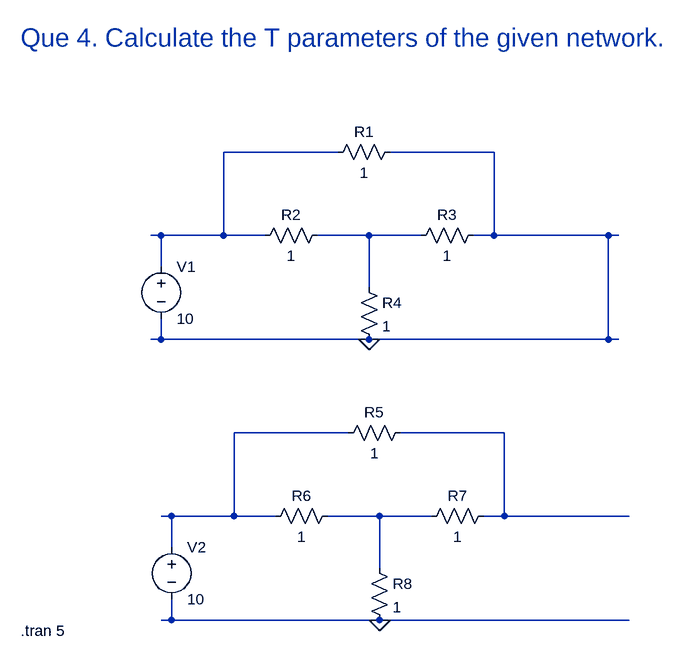
[diagram p0: schematic 4_Dheerendra_23EE019_Two_port_T_Para.asc]
4_Dheerendra_23EE019_Two_port_T_Para.asc, the LTspice schematic file:
Version 4
SHEET 1 880 832
WIRE 224 80 48 80
WIRE 464 80 304 80
WIRE -48 208 -64 208
WIRE 48 208 48 80
WIRE 48 208 -48 208
WIRE 112 208 48 208
WIRE 272 208 192 208
WIRE 352 208 272 208
WIRE 464 208 464 80
WIRE 464 208 432 208
WIRE 640 208 464 208
WIRE 656 208 640 208
WIRE -48 256 -48 208
WIRE 272 288 272 208
WIRE -48 368 -48 336
WIRE -48 368 -64 368
WIRE 272 368 -48 368
WIRE 640 368 640 208
WIRE 640 368 272 368
WIRE 656 368 640 368
WIRE 240 512 64 512
WIRE 480 512 320 512
WIRE -32 640 -48 640
WIRE 64 640 64 512
WIRE 64 640 -32 640
WIRE 128 640 64 640
WIRE 288 640 208 640
WIRE 368 640 288 640
WIRE 480 640 480 512
WIRE 480 640 448 640
WIRE 672 640 480 640
WIRE -32 688 -32 640
WIRE 288 720 288 640
WIRE -32 800 -32 768
WIRE -32 800 -48 800
WIRE 288 800 -32 800
WIRE 672 800 288 800
FLAG 272 368 0
FLAG 288 800 0
SYMBOL res 320 64 R90
WINDOW 0 0 56 VBottom 2
WINDOW 3 32 56 VTop 2
SYMATTR InstName R1
SYMATTR Value 1
SYMBOL res 208 192 R90
WINDOW 0 0 56 VBottom 2
WINDOW 3 32 56 VTop 2
SYMATTR InstName R2
SYMATTR Value 1
SYMBOL res 448 192 R90
WINDOW 0 0 56 VBottom 2
WINDOW 3 32 56 VTop 2
SYMATTR InstName R3
SYMATTR Value 1
SYMBOL res 256 272 R0
SYMATTR InstName R4
SYMATTR Value 1
SYMBOL res 336 496 R90
WINDOW 0 0 56 VBottom 2
WINDOW 3 32 56 VTop 2
SYMATTR InstName R5
SYMATTR Value 1
SYMBOL res 224 624 R90
WINDOW 0 0 56 VBottom 2
WINDOW 3 32 56 VTop 2
SYMATTR InstName R6
SYMATTR Value 1
SYMBOL res 464 624 R90
WINDOW 0 0 56 VBottom 2
WINDOW 3 32 56 VTop 2
SYMATTR InstName R7
SYMATTR Value 1
SYMBOL res 272 704 R0
SYMATTR InstName R8
SYMATTR Value 1
SYMBOL voltage -48 240 R0
WINDOW 123 0 0 Left 0
WINDOW 39 0 0 Left 0
SYMATTR InstName V1
SYMATTR Value 10
SYMBOL voltage -32 672 R0
WINDOW 123 0 0 Left 0
WINDOW 39 0 0 Left 0
SYMATTR InstName V2
SYMATTR Value 10
TEXT -264 -96 Left 4 ;Que 4. Calculate the T parameters of the given network.
TEXT -264 816 Left 2 !.tran 5

The netlist it stands for:
* 4_Dheerendra_23EE019_Two_port_T_Para.asc
R1 0 N001 1
R2 N002 N001 1
R3 0 N002 1
R4 N002 0 1
R5 N004 N003 1
R6 N005 N003 1
R7 N004 N005 1
R8 N005 0 1
V1 N001 0 10
V2 N003 0 10
* Que 4. Calculate the T parameters of the given network.
.tran 5
.backanno
.end